# EAGLE design Hirose64-ONIX-OE-Interposer (EAGLE 9.6.2)
DESIGNER: JON NEWMAN, JAKOB VOIGTS; DESIGN_NAME: HEADSTAGE-64; LICENSE: CERN OHL v1.2; REVISION: 1.2
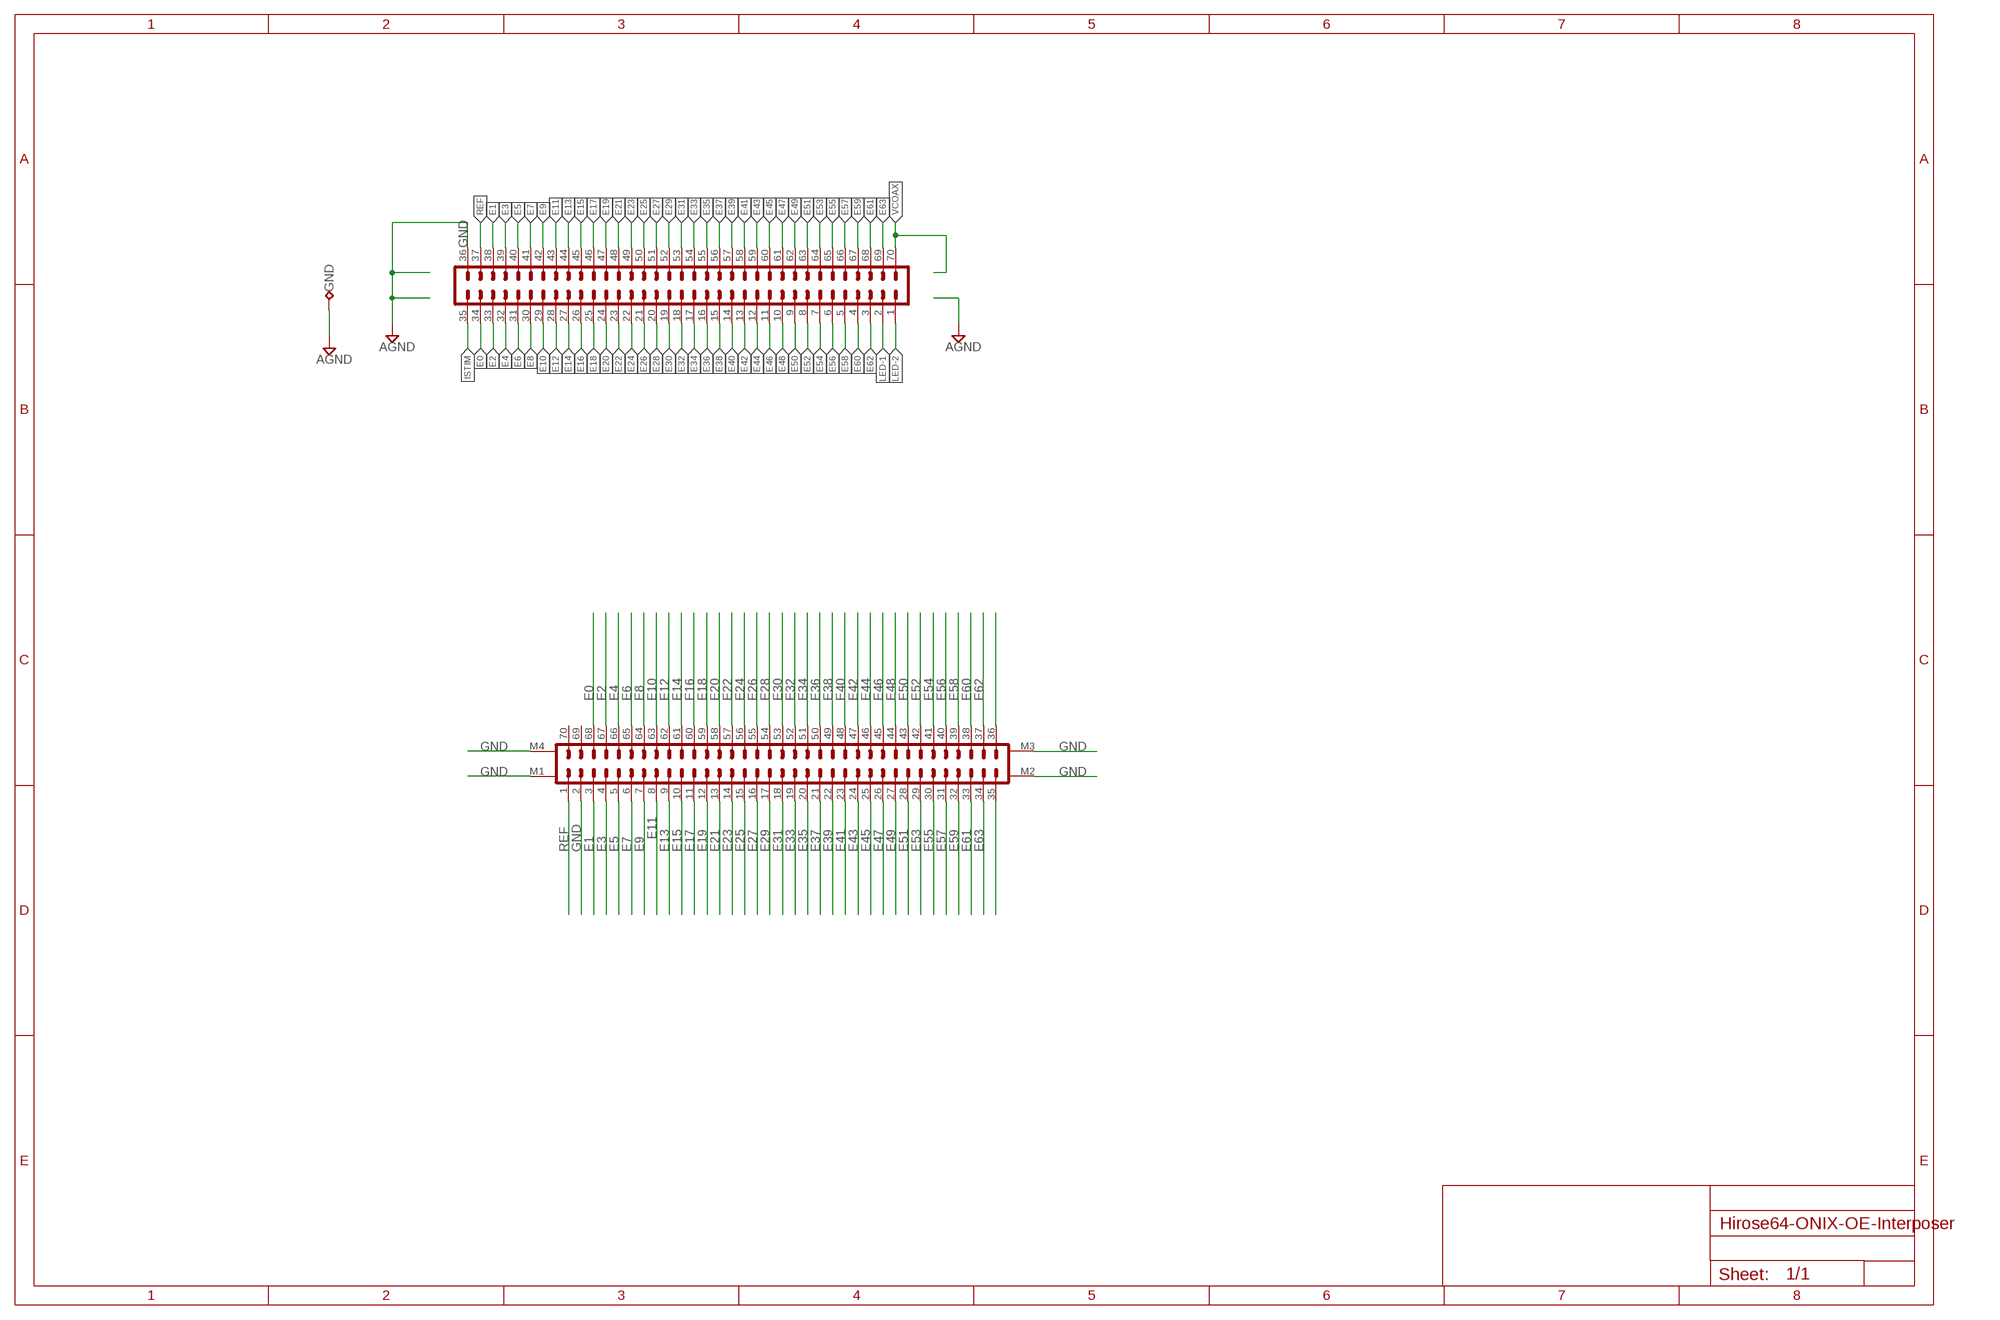
[diagram p0: schematic, sheet 1]

## Parts
GND  GND  TPTP07R  [TP07R]
J3  DF40-REC  PINHD-2X35_DF40REF-LRG  [DDF40-70REC-LRG]
J4  DF40C-70DP-0.4V(51)  PINHD-2X35+4DF40-70HEAD-LESS-SILK  [DF40-70HEAD-LESS-SILK]

## Nets
E0: J3.34 J4.68
E1: J3.38 J4.3
E2: J3.33 J4.67
E3: J3.39 J4.4
E4: J3.32 J4.66
E5: J3.40 J4.5
E6: J3.31 J4.65
E7: J3.41 J4.6
E8: J3.30 J4.64
E9: J3.42 J4.7
E10: J3.29 J4.63
E11: J3.43 J4.8
E12: J3.28 J4.62
E13: J3.44 J4.9
E14: J3.27 J4.61
E15: J3.45 J4.10
E16: J3.26 J4.60
E17: J3.46 J4.11
E18: J3.25 J4.59
E19: J3.47 J4.12
E20: J3.24 J4.58
E21: J3.48 J4.13
E22: J3.23 J4.57
E23: J3.49 J4.14
E24: J3.22 J4.56
E25: J3.50 J4.15
E26: J3.21 J4.55
E27: J3.51 J4.16
E28: J3.20 J4.54
E29: J3.52 J4.17
E30: J3.19 J4.53
E31: J3.53 J4.18
E32: J3.18 J4.52
E33: J3.54 J4.19
E34: J3.17 J4.51
E35: J3.55 J4.20
E36: J3.16 J4.50
E37: J3.56 J4.21
E38: J3.15 J4.49
E39: J3.57 J4.22
E40: J3.14 J4.48
E41: J3.58 J4.23
E42: J3.13 J4.47
E43: J3.59 J4.24
E44: J3.12 J4.46
E45: J3.60 J4.25
E46: J3.11 J4.45
E47: J3.61 J4.26
E48: J3.10 J4.44
E49: J3.62 J4.27
E50: J3.9 J4.43
E51: J3.63 J4.28
E52: J3.8 J4.42
E53: J3.64 J4.29
E54: J3.7 J4.41
E55: J3.65 J4.30
E56: J3.6 J4.40
E57: J3.66 J4.31
E58: J3.5 J4.39
E59: J3.67 J4.32
E60: J3.4 J4.38
E61: J3.68 J4.33
E62: J3.3 J4.37
E63: J3.69 J4.34
ESTIM: J4.35
GND: GND.TP J3.36 J4.2 J4.M1 J4.M2 J4.M3 J4.M4 ; supply symbol labelled AGND
ISTIM: J3.35
LED-1: J3.2
LED-2: J3.1
REF: J3.37 J4.1
REF1: J4.36
VCOAX: J3.70
Unconnected: J4.69 J4.70

## Library data of the parts
GND = jonnew:TP: Test pad
J3 = jonnew:PINHD-2X35
J4 = jonnew:PINHD-2X35+4

## Net classes
1 thick: width 0.102 mm
2 diff: width 0.076 mm, drill 0.1 mm, clearance 0.051 mm

## Board
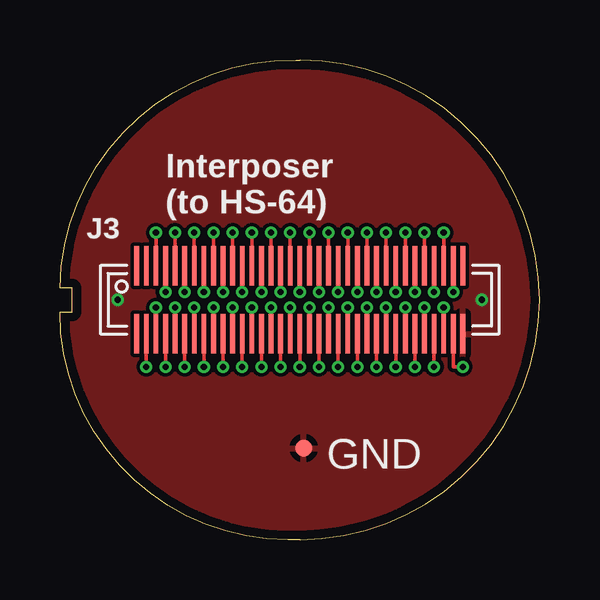
[diagram p1: board, top side]
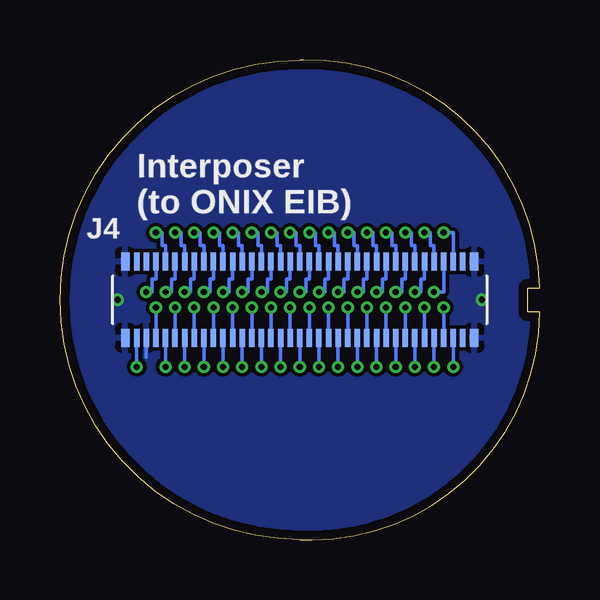
[diagram p2: board, bottom side, seen from below]

Size 20 x 20 mm. Coordinates in mm from the lower left corner, seen from the top.
Outline: 10,0 9.5,0 arc-90 0,9.5 0.5,9.5 0.5,10.5 0,10.5 arc-90 9.84,20 10,20 arc-90 20,10 arc-90 10,0
Copper layers (1*16): Top 0.035559375mm / dielectric 1.6mm / Bottom 0.035559375mm
Design rules "oshpark-2layer": minimum track width 6mil, minimum drill 10mil, track to track 6mil, track to pad 6mil, pad to pad 6mil, via to via 6mil, smd to smd 6mil, copper to edge 15mil, drill to drill 6mil, minimum pad ring 5mil, minimum via ring 5mil, stop-mask expansion 2.5mil, vias tented up to drill 0mil, thermal gap 10mil

### Footprints (pad centres in the part's own frame; a part is rotated, then mirrored left to right if it is on the bottom)
TP07R = smd 0.7 x 0.7: TP 0,0
DDF40-70REC-LRG = smd 0.2 x 1.64: 1 -6.8,1.42; 2 -6.4,1.42; 3 -6,1.42; 4 -5.6,1.42; 5 -5.2,1.42; 6 -4.8,1.42; 7 -4.4,1.42; 8 -4,1.42; 9 -3.6,1.42; 10 -3.2,1.42; 11 -2.8,1.42; 12 -2.4,1.42; 13 -2,1.42; 14 -1.6,1.42; 15 -1.2,1.42; 16 -0.8,1.42; 17 -0.4,1.42; 18 0,1.42; 19 0.4,1.42; 20 0.8,1.42; 21 1.2,1.42; 22 1.6,1.42; 23 2,1.42; 24 2.4,1.42; 25 2.8,1.42; 26 3.2,1.42; 27 3.6,1.42; 28 4,1.42; 29 4.4,1.42; 30 4.8,1.42; 31 5.2,1.42; 32 5.6,1.42; 33 6,1.42; 34 6.4,1.42; 35 6.8,1.42; 36 6.8,-1.42; 37 6.4,-1.42; 38 6,-1.42; 39 5.6,-1.42; 40 5.2,-1.42; 41 4.8,-1.42; 42 4.4,-1.42; 43 4,-1.42; 44 3.6,-1.42; 45 3.2,-1.42; 46 2.8,-1.42; 47 2.4,-1.42; 48 2,-1.42; 49 1.6,-1.42; 50 1.2,-1.42; 51 0.8,-1.42; 52 0.4,-1.42; 53 0,-1.42; 54 -0.4,-1.42; 55 -0.8,-1.42; 56 -1.2,-1.42; 57 -1.6,-1.42; 58 -2,-1.42; 59 -2.4,-1.42; 60 -2.8,-1.42; 61 -3.2,-1.42; 62 -3.6,-1.42; 63 -4,-1.42; 64 -4.4,-1.42; 65 -4.8,-1.42; 66 -5.2,-1.42; 67 -5.6,-1.42; 68 -6,-1.42; 69 -6.4,-1.42; 70 -6.8,-1.42
DF40-70HEAD-LESS-SILK = smd 0.23 x 0.75: 1 -6.8,-1.585; 2 -6.4,-1.585; 3 -6,-1.585; 4 -5.6,-1.585; 5 -5.2,-1.585; 6 -4.8,-1.585; 7 -4.4,-1.585; 8 -4,-1.585; 9 -3.6,-1.585; 10 -3.2,-1.585; 11 -2.8,-1.585; 12 -2.4,-1.585; 13 -2,-1.585; 14 -1.6,-1.585; 15 -1.2,-1.585; 16 -0.8,-1.585; 17 -0.4,-1.585; 18 0,-1.585; 19 0.4,-1.585; 20 0.8,-1.585; 21 1.2,-1.585; 22 1.6,-1.585; 23 2,-1.585; 24 2.4,-1.585; 25 2.8,-1.585; 26 3.2,-1.585; 27 3.6,-1.585; 28 4,-1.585; 29 4.4,-1.585; 30 4.8,-1.585; 31 5.2,-1.585; 32 5.6,-1.585; 33 6,-1.585; 34 6.4,-1.585; 35 6.8,-1.585; 36 6.8,1.585; 37 6.4,1.585; 38 6,1.585; 39 5.6,1.585; 40 5.2,1.585; 41 4.8,1.585; 42 4.4,1.585; 43 4,1.585; 44 3.6,1.585; 45 3.2,1.585; 46 2.8,1.585; 47 2.4,1.585; 48 2,1.585; 49 1.6,1.585; 50 1.2,1.585; 51 0.8,1.585; 52 0.4,1.585; 53 0,1.585; 54 -0.4,1.585; 55 -0.8,1.585; 56 -1.2,1.585; 57 -1.6,1.585; 58 -2,1.585; 59 -2.4,1.585; 60 -2.8,1.585; 61 -3.2,1.585; 62 -3.6,1.585; 63 -4,1.585; 64 -4.4,1.585; 65 -4.8,1.585; 66 -5.2,1.585; 67 -5.6,1.585; 68 -6,1.585; 69 -6.4,1.585; 70 -6.8,1.585 | smd 0.35 x 0.75: M1 -7.275,-1.585; M2 7.275,-1.585; M3 7.275,1.585; M4 -7.275,1.585

### Placement (x,y rotation side)
GND  10.16,3.81 0 top
J3  10,10 0 top
J4  10,10 0 bottom

### Tracks (layer width: path | path; a pad name or v marks a point on that pad's centre or on a via)
E0  (via drill 0.25)
  Top 0.152: J3.34 v16.4,10.32
  Bottom 0.152: v16.4,10.32 16.15,10.32 16.15,10.87 16,10.87 J4.68
E1  (via drill 0.25)
  Top 0.152: v16,9.68 J3.38
  Bottom 0.152: J4.3 v16,9.68
E2  (via drill 0.25)
  Top 0.152: J3.33 v16,12.8
  Bottom 0.152: J4.67 15.6,12.25 15.75,12.25 15.75,12.8 v16,12.8
E3  (via drill 0.25)
  Top 0.152: v15.6,7.2 J3.39
  Bottom 0.152: J4.4 v15.6,7.2
E4  (via drill 0.25)
  Top 0.152: J3.32 v15.6,10.32
  Bottom 0.152: v15.6,10.32 15.35,10.32 15.35,10.87 15.2,10.87 J4.66
E5  (via drill 0.25)
  Top 0.152: J3.40 v15.2,9.68
  Bottom 0.152: v15.2,9.68 J4.5
E6  (via drill 0.25)
  Top 0.152: J3.31 v15.2,12.8
  Bottom 0.152: J4.65 14.8,12.25 14.95,12.25 14.95,12.8 v15.2,12.8
E7  (via drill 0.25)
  Top 0.152: J3.41 v14.8,7.2
  Bottom 0.152: v14.8,7.2 J4.6
E8  (via drill 0.25)
  Top 0.152: J3.30 v14.8,10.32
  Bottom 0.152: v14.8,10.32 14.55,10.32 14.55,10.87 14.4,10.87 J4.64
E9  (via drill 0.25)
  Top 0.152: v14.4,9.68 J3.42
  Bottom 0.152: J4.7 v14.4,9.68
E10  (via drill 0.25)
  Top 0.152: J3.29 v14.4,12.8
  Bottom 0.152: J4.63 14,12.25 14.15,12.25 14.15,12.8 v14.4,12.8
E11  (via drill 0.25)
  Top 0.152: v14,7.2 J3.43
  Bottom 0.152: J4.8 v14,7.2
E12  (via drill 0.25)
  Top 0.152: J3.28 v14,10.32
  Bottom 0.152: v14,10.32 13.75,10.32 13.75,10.87 13.6,10.87 J4.62
E13  (via drill 0.25)
  Top 0.152: v13.6,9.68 J3.44
  Bottom 0.152: J4.9 v13.6,9.68
E14  (via drill 0.25)
  Top 0.152: J3.27 v13.6,12.8
  Bottom 0.152: J4.61 13.2,12.25 13.35,12.25 13.35,12.8 v13.6,12.8
E15  (via drill 0.25)
  Top 0.152: J3.45 v13.2,7.2
  Bottom 0.152: v13.2,7.2 J4.10
E16  (via drill 0.25)
  Top 0.152: J3.26 v13.2,10.32
  Bottom 0.152: v13.2,10.32 12.95,10.32 12.95,10.87 12.8,10.87 J4.60
E17  (via drill 0.25)
  Top 0.152: J3.46 v12.8,9.68
  Bottom 0.152: v12.8,9.68 J4.11
E18  (via drill 0.25)
  Top 0.152: J3.25 v12.8,12.8
  Bottom 0.152: J4.59 12.4,12.25 12.55,12.25 12.55,12.8 v12.8,12.8
E19  (via drill 0.25)
  Top 0.152: v12.4,7.2 J3.47
  Bottom 0.152: J4.12 v12.4,7.2
E20  (via drill 0.25)
  Top 0.152: J3.24 v12.4,10.32
  Bottom 0.152: v12.4,10.32 12.15,10.32 12.15,10.87 12,10.87 J4.58
E21  (via drill 0.25)
  Top 0.152: v12,9.68 J3.48
  Bottom 0.152: J4.13 v12,9.68
E22  (via drill 0.25)
  Top 0.152: J3.23 v12,12.8
  Bottom 0.152: J4.57 11.6,12.25 11.75,12.25 11.75,12.8 v12,12.8
E23  (via drill 0.25)
  Top 0.152: J3.49 v11.6,7.2
  Bottom 0.152: v11.6,7.2 J4.14
E24  (via drill 0.25)
  Top 0.152: J3.22 v11.6,10.32
  Bottom 0.152: v11.6,10.32 11.35,10.32 11.35,10.87 11.2,10.87 J4.56
E25  (via drill 0.25)
  Top 0.152: J3.50 v11.2,9.68
  Bottom 0.152: v11.2,9.68 J4.15
E26  (via drill 0.25)
  Top 0.152: J3.21 v11.2,12.8
  Bottom 0.152: J4.55 10.8,12.25 10.95,12.25 10.95,12.8 v11.2,12.8
E27  (via drill 0.25)
  Top 0.152: v10.8,7.2 J3.51
  Bottom 0.152: J4.16 v10.8,7.2
E28  (via drill 0.25)
  Top 0.152: J3.20 v10.8,10.32
  Bottom 0.152: v10.8,10.32 10.55,10.32 10.55,10.87 10.4,10.87 J4.54
E29  (via drill 0.25)
  Top 0.152: v10.4,9.68 J3.52
  Bottom 0.152: J4.17 v10.4,9.68
E30  (via drill 0.25)
  Top 0.152: J3.19 v10.4,12.8
  Bottom 0.152: J4.53 10,12.25 10.15,12.25 10.15,12.8 v10.4,12.8
E31  (via drill 0.25)
  Top 0.152: J3.53 v10,7.2
  Bottom 0.152: v10,7.2 J4.18
E32  (via drill 0.25)
  Top 0.152: J3.18 v10,10.32
  Bottom 0.152: v10,10.32 9.75,10.32 9.75,10.87 9.6,10.87 J4.52
E33  (via drill 0.25)
  Top 0.152: J3.54 v9.6,9.68
  Bottom 0.152: v9.6,9.68 J4.19
E34  (via drill 0.25)
  Top 0.152: J3.17 v9.6,12.8
  Bottom 0.152: J4.51 9.2,12.25 9.35,12.25 9.35,12.8 v9.6,12.8
E35  (via drill 0.25)
  Top 0.152: v9.2,7.2 J3.55
  Bottom 0.152: J4.20 v9.2,7.2
E36  (via drill 0.25)
  Top 0.152: J3.16 v9.2,10.32
  Bottom 0.152: v9.2,10.32 8.95,10.32 8.95,10.87 8.8,10.87 J4.50
E37  (via drill 0.25)
  Top 0.152: v8.8,9.68 J3.56
  Bottom 0.152: J4.21 v8.8,9.68
E38  (via drill 0.25)
  Top 0.152: J3.15 v8.8,12.8
  Bottom 0.152: J4.49 8.4,12.25 8.55,12.25 8.55,12.8 v8.8,12.8
E39  (via drill 0.25)
  Top 0.152: J3.57 v8.4,7.2
  Bottom 0.152: v8.4,7.2 J4.22
E40  (via drill 0.25)
  Top 0.152: J3.14 v8.4,10.32
  Bottom 0.152: v8.4,10.32 8.15,10.32 8.15,10.87 8,10.87 J4.48
E41  (via drill 0.25)
  Top 0.152: J3.58 v8,9.68
  Bottom 0.152: v8,9.68 J4.23
E42  (via drill 0.25)
  Top 0.152: J3.13 v8,12.8
  Bottom 0.152: J4.47 7.6,12.25 7.75,12.25 7.75,12.8 v8,12.8
E43  (via drill 0.25)
  Top 0.152: v7.6,7.2 J3.59
  Bottom 0.152: J4.24 v7.6,7.2
E44  (via drill 0.25)
  Top 0.152: J3.12 v7.6,10.32
  Bottom 0.152: v7.6,10.32 7.35,10.32 7.35,10.87 7.2,10.87 J4.46
E45  (via drill 0.25)
  Top 0.152: v7.2,9.68 J3.60
  Bottom 0.152: J4.25 v7.2,9.68
E46  (via drill 0.25)
  Top 0.152: J3.11 v7.2,12.8
  Bottom 0.152: J4.45 6.8,12.25 6.95,12.25 6.95,12.8 v7.2,12.8
E47  (via drill 0.25)
  Top 0.152: J3.61 v6.8,7.2
  Bottom 0.152: v6.8,7.2 J4.26
E48  (via drill 0.25)
  Top 0.152: J3.10 v6.8,10.32
  Bottom 0.152: v6.8,10.32 6.55,10.32 6.55,10.87 6.4,10.87 J4.44
E49  (via drill 0.25)
  Top 0.152: J3.62 v6.4,9.68
  Bottom 0.152: v6.4,9.68 J4.27
E50  (via drill 0.25)
  Top 0.152: J3.9 v6.4,12.8
  Bottom 0.152: v6.4,12.8 6.15,12.8 6.15,12.25 6,12.25 J4.43
E51  (via drill 0.25)
  Top 0.152: v6,7.2 J3.63
  Bottom 0.152: J4.28 v6,7.2
E52  (via drill 0.25)
  Top 0.152: J3.8 v6,10.32
  Bottom 0.152: v6,10.32 5.75,10.32 5.75,10.87 5.6,10.87 J4.42
E53  (via drill 0.25)
  Top 0.152: v5.6,9.68 J3.64
  Bottom 0.152: J4.29 v5.6,9.68
E54  (via drill 0.25)
  Top 0.152: J3.7 v5.6,12.8
  Bottom 0.152: J4.41 5.2,12.25 5.35,12.25 5.35,12.8 v5.6,12.8
E55  (via drill 0.25)
  Top 0.152: J3.65 v5.2,7.2
  Bottom 0.152: v5.2,7.2 J4.30
E56  (via drill 0.25)
  Top 0.152: J3.6 v5.2,10.32
  Bottom 0.152: v5.2,10.32 4.95,10.32 4.95,10.87 4.8,10.87 J4.40
E57  (via drill 0.25)
  Top 0.152: J3.66 v4.8,9.68
  Bottom 0.152: v4.8,9.68 J4.31
E58  (via drill 0.25)
  Top 0.152: J3.5 v4.8,12.8
  Bottom 0.152: v4.8,12.8 4.55,12.8 4.55,12.25 4.4,12.25 J4.39
E59  (via drill 0.25)
  Top 0.152: v4.4,7.2 J3.67
  Bottom 0.152: J4.32 v4.4,7.2
E60  (via drill 0.25)
  Top 0.152: J3.4 v4.4,10.32
  Bottom 0.152: v4.4,10.32 4,10.32 J4.38
E61  (via drill 0.25)
  Top 0.152: J3.68 v4,9.68
  Bottom 0.152: v4,9.68 J4.33
E62  (via drill 0.25)
  Top 0.152: J3.3 v4,12.8
  Bottom 0.152: v4,12.8 3.6,12.8 J4.37
E63  (via drill 0.25)
  Top 0.152: v3.6,7.2 J3.69
  Bottom 0.152: J4.34 v3.6,7.2
GND  (via drill 0.25)
  Bottom 0.152: J4.2 16.4,7.6
  other vias: 17.6,10 2.4,10
  pour Top: 0,0 0,20 20,20 20,0
  pour Bottom: 0,0 20,0 20,20 0,20
REF  (via drill 0.25)
  Top 0.152: v16.8,7.2 16.4,7.2 J3.37
  Bottom 0.152: J4.1 v16.8,7.2

### Text on the board
tPlace: Interposer / (to HS-64)
bPlace: Interposer / (to ONIX EIB)